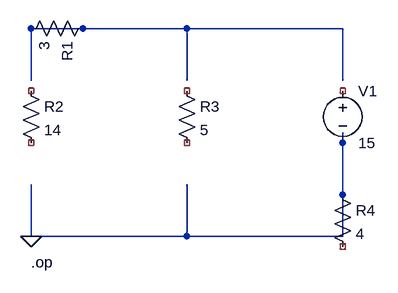
[diagram p0: schematic 01_circuit_generated-by-claude-sonnet-4-6.asc]
01_circuit_generated-by-claude-sonnet-4-6.asc, the LTspice schematic file:
Version 4
SHEET 1 880 680
WIRE 80 80 320 80
WIRE 320 80 560 80
WIRE 80 80 80 160
WIRE 80 320 80 400
WIRE 80 400 560 400
WIRE 320 80 320 160
WIRE 320 320 320 400
WIRE 560 80 560 160
WIRE 560 240 560 320
WIRE 560 320 560 400
SYMBOL res 176 64 R90
SYMATTR InstName R1
SYMATTR Value 3
SYMBOL res 64 160 R0
SYMATTR InstName R2
SYMATTR Value 14
SYMBOL res 304 160 R0
SYMATTR InstName R3
SYMATTR Value 5
SYMBOL voltage 560 160 R0
SYMATTR InstName V1
SYMATTR Value 15
SYMBOL res 544 320 R0
SYMATTR InstName R4
SYMATTR Value 4
FLAG 80 400 0
TEXT 80 440 Left 2 !.op

The netlist it stands for:
* 01_circuit_generated-by-claude-sonnet-4-6.asc
R1 N001 N001 3
R2 NC_01 NC_02 14
R3 NC_03 NC_04 5
V1 NC_05 0 15
R4 0 NC_06 4
.op
.backanno
.end